# Altium schematic sheet Communication and peripherals ETH.SchDoc
size A4
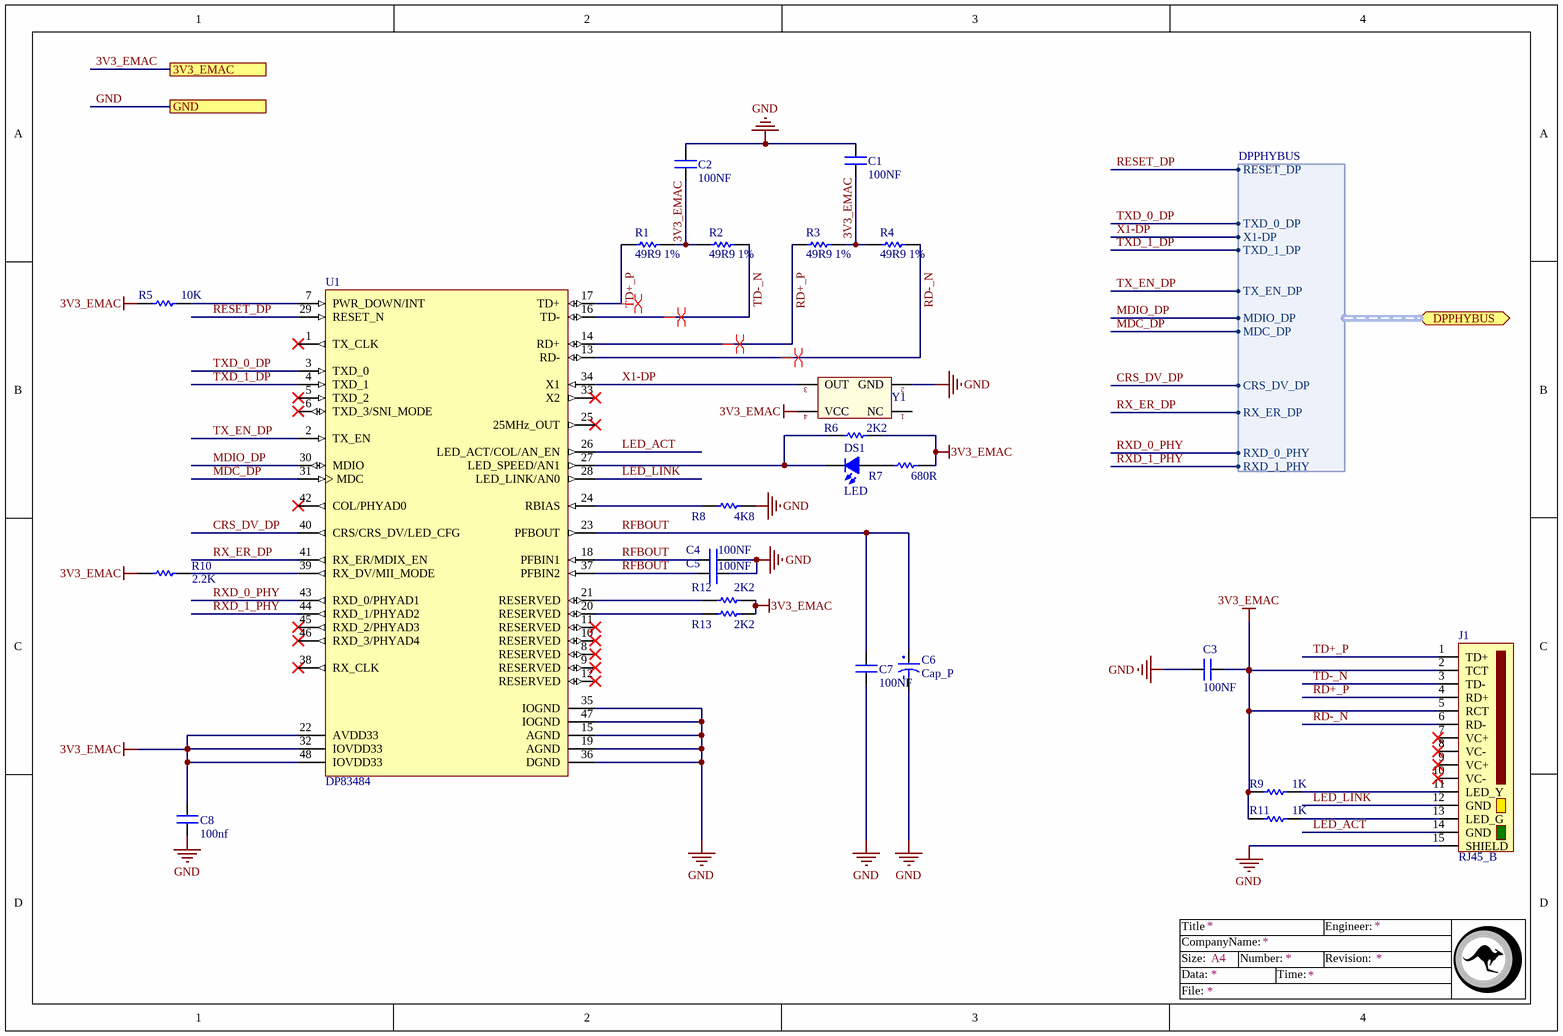
[diagram p0: Communication and peripherals ETH.SchDoc]

## Parts
C1  100NF  [Cap0805]
C2  100NF  [Cap0805]
C3  100NF  [Cap0805]
C4  100NF  [Cap0805]
C5  100NF  [Cap0805]
C6  Cap_P  [Cap_4mm]
C7  100NF  [Cap0805]
C8  100nf  [Cap0805]
DS1  LED  [Led0805]
J1  RJ45_B  [RJ45_B]
R1  49R9 1%  [R0805]
R2  49R9 1%  [R0805]
R3  49R9 1%  [R0805]
R4  49R9 1%  [R0805]
R5  10K  [R0805]
R6  2K2  [R0805]
R7  680R  [R0805]
R8  4K8  [R0805]
R9  1K  [R0805]
R10  2.2K  [R0805]
R11  1K  [R0805]
R12  2K2  [R0805]
R13  2K2  [R0805]
U1  DP83484  [DP83484]
Y1  Oscillator  [Crystall 50Mhz]  (value not drawn)

## Ports
3V3_EMAC, DPPHYBUS (bidir, harness DPPHYBUS), GND

## Harnesses
DPPHYBUS: RESET_DP, TXD_0_DP, X1-DP, TXD_1_DP, TX_EN_DP, MDIO_DP, MDC_DP, CRS_DV_DP, RX_ER_DP, RXD_0_PHY, RXD_1_PHY

## Nets
3V3_EMAC: C1.1 C2.1 C3.1 C8.2 J1.2(TCT) J1.5(RCT) R1.2 R2.1 R3.2 R4.1 R5.2 R6.1 R7.1 R9.1 R10.2 R11.1 R12.1 R13.1 U1.22(AVDD33) U1.32(IOVDD33) U1.48(IOVDD33) Y1.4(VCC) ; port 3V3_EMAC
GND: C1.2 C2.2 C3.2 C4.2 C5.2 C6.1 C7.1 C8.1 J1.15(SHIELD) U1.15(AGND) U1.19(AGND) U1.35(IOGND) U1.36(DGND) U1.47(IOGND) Y1.2(GND) ; port GND
CRS_DV_DP: U1.40(CRS/CRS_DV/LED_CFG) ; port DPPHYBUS.CRS_DV_DP
LED_ACT: J1.14(GND) U1.26(LED_ACT/COL/AN_EN)
LED_LINK: J1.12(GND) U1.28(LED_LINK/AN0)
MDC_DP: U1.31(MDC) ; port DPPHYBUS.MDC_DP
MDIO_DP: U1.30(MDIO) ; port DPPHYBUS.MDIO_DP
RD+_P: J1.4(RD+) R3.1 U1.14(RD+)
RD-_N: J1.6(RD-) R4.2 U1.13(RD-)
RESET_DP: U1.29(RESET_N) ; port DPPHYBUS.RESET_DP
RFBOUT: C4.1 C5.1 C6.2 C7.2 U1.18(PFBIN1) U1.23(PFBOUT) U1.37(PFBIN2)
RX_ER_DP: U1.41(RX_ER/MDIX_EN) ; port DPPHYBUS.RX_ER_DP
RXD_0_PHY: U1.43(RXD_0/PHYAD1) ; port DPPHYBUS.RXD_0_PHY
RXD_1_PHY: U1.44(RXD_1/PHYAD2) ; port DPPHYBUS.RXD_1_PHY
TD+_P: J1.1(TD+) R1.1 U1.17(TD+)
TD-_N: J1.3(TD-) R2.2 U1.16(TD-)
TX_EN_DP: U1.2(TX_EN) ; port DPPHYBUS.TX_EN_DP
TXD_0_DP: U1.3(TXD_0) ; port DPPHYBUS.TXD_0_DP
TXD_1_DP: U1.4(TXD_1) ; port DPPHYBUS.TXD_1_DP
X1-DP: U1.34(X1) Y1.3(OUT) ; port DPPHYBUS.X1-DP
NetDS1_A: DS1.A R7.2
NetDS1_K: DS1.K R6.2 U1.27(LED_SPEED/AN1)
NetJ1_11: J1.11(LED_Y) R9.2
NetJ1_13: J1.13(LED_G) R11.2
NetR5_1: R5.1 U1.7(PWR_DOWN/INT)
NetR8_2: R8.2 U1.24(RBIAS)
NetR10_1: R10.1 U1.39(RX_DV/MII_MODE)
NetR12_2: R12.2 U1.21(RESERVED)
NetR13_2: R13.2 U1.20(RESERVED)

Not connected (* = marked no-connect by the designer): J1 7(VC+)* 8(VC-)* 9(VC+)* 10(VC-)*; R8 1; U1 1(TX_CLK)* 5(TXD_2)* 6(TXD_3/SNI_MODE)* 8(RESERVED)* 9(RESERVED)* 10(RESERVED)* 11(RESERVED)* 12(RESERVED)* 25(25MHz_OUT)* 33(X2)* 38(RX_CLK)* 42(COL/PHYAD0)* 45(RXD_2/PHYAD3)* 46(RXD_3/PHYAD4)*; Y1 1(NC)

## Layout directives
differential pair: RD+_P, RD-_N, TD+_P, TD-_N

## Notes on the sheet
- Labels drawn without touching a wire or pin: GND
- Title
- Size:
- Data:
- CompanyName:
- A4
- Number:
- Time:
- Revision:
- Engineer:
- File:

## Library data of the parts
C1-C5 C7 C8 = Cap: Surface mount Capacitor
C6 = Cap_P: Polarity
J1 = RJ45_B: Ethernet Connector
R1-R13 = Resistor
U1 = DP83484: Ethernet PHY